# EAGLE design pic (EAGLE 5.06)
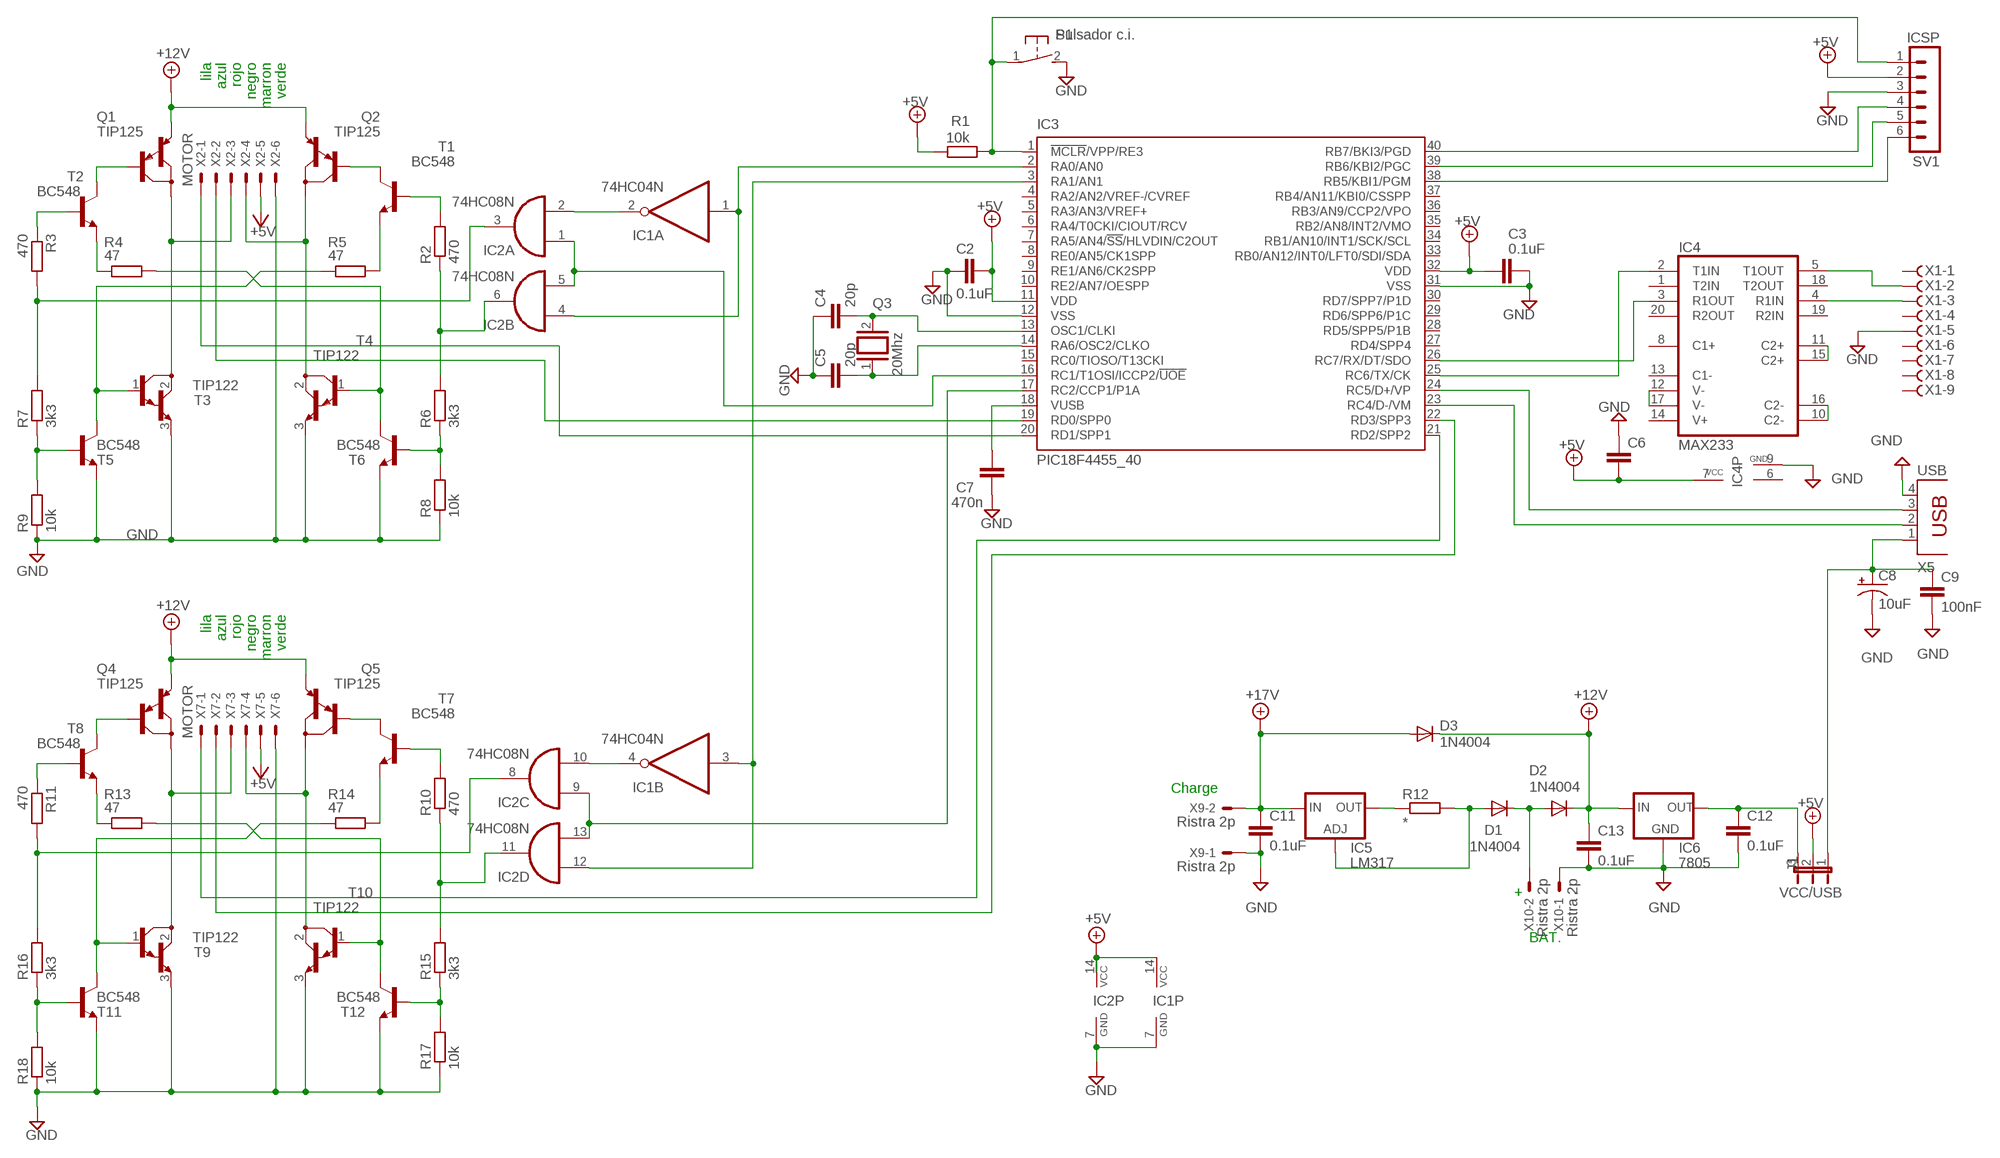
[diagram p0: schematic, sheet 1]

## Parts
C2  0.1uF  C2,5-3  [C2.5-3]
C3  0.1uF  C2,5-3  [C2.5-3]
C4  20p  C2,5-3  [C2.5-3]
C5  20p  C2,5-3  [C2.5-3]
C6  C2,5-3  [C2.5-3]
C7  470n  C2,5-3  [C2.5-3]
C8  10uF  CPOL-USE1.8-4  [E1,8-4]
C9  100nF  C2,5-3  [C2.5-3]
C11  0.1uF  C2,5-3  [C2.5-3]
C12  0.1uF  C2,5-3  [C2.5-3]
C13  0.1uF  C2,5-3  [C2.5-3]
D1  1N4004  [DO41-10]
D2  1N4004  [DO41-10]
D3  1N4004  [DO41-10]
IC1  74HC04N  [DIL14]
IC2  74HC08N  [DIL14]
IC3  PIC18F4455_40  [DIL40]
IC4  MAX233  [DIL20]
IC5  LM317  LM317TS  [317TS]
IC6  7805  78XXS  [78XXS]
J1  VCC/USB  JP2E  [JP2]
Q1  TIP125  [TO220V]
Q2  TIP125  [TO220V]
Q3  20Mhz  XTAL/S  [QS]
Q4  TIP125  [TO220V]
Q5  TIP125  [TO220V]
R1  10k  R-EU_0204/5  [0204/5]
R2  470  R-EU_0204/7  [0204/7]
R3  470  R-EU_0204/7  [0204/7]
R4  47  R-EU_0204/7  [0204/7]
R5  47  R-EU_0204/7  [0204/7]
R6  3k3  R-EU_0204/7  [0204/7]
R7  3k3  R-EU_0204/7  [0204/7]
R8  10k  R-EU_0204/7  [0204/7]
R9  10k  R-EU_0204/7  [0204/7]
R10  470  R-EU_0204/7  [0204/7]
R11  470  R-EU_0204/7  [0204/7]
R12  *  R-EU_0204/5  [0204/5]
R13  47  R-EU_0204/7  [0204/7]
R14  47  R-EU_0204/7  [0204/7]
R15  3k3  R-EU_0204/7  [0204/7]
R16  3k3  R-EU_0204/7  [0204/7]
R17  10k  R-EU_0204/7  [0204/7]
R18  10k  R-EU_0204/7  [0204/7]
S1  Pulsador c.i.  31-XX  [B3F-31XX]
SV1  ICSP  MA06-1  [MA06-1]
T1  BC548  [TO92-EBC]
T2  BC548  [TO92-EBC]
T3  TIP122  [TO220V]
T4  TIP122  [TO220V]
T5  BC548  [TO92-EBC]
T6  BC548  [TO92-EBC]
T7  BC548  [TO92-EBC]
T8  BC548  [TO92-EBC]
T9  TIP122  [TO220V]
T10  TIP122  [TO220V]
T11  BC548  [TO92-EBC]
T12  BC548  [TO92-EBC]
X1  F09HPS  [F09HP]
X2  MOTOR  C-GRID-06-70543  [70543-06]
X5  USB  PN61729  [PN61729]
X7  MOTOR  C-GRID-06-70543  [70543-06]
X9  Ristra 2p  KK-156-2  [KK-156-2]
X10  Ristra 2p  KK-156-2  [KK-156-2]

## Nets
+5V: C2.2 C3.1 C6.2 IC1.14(P:VCC) IC2.14(P:VCC) IC3.11(VDD) IC3.32(VDD) IC4.7(VCC) J1.2 R1.2 SV1.2 X2.5 X7.5
+12V: C13.1 D2.C D3.C IC6.IN Q1.3(E) Q2.3(E) Q4.3(E) Q5.3(E)
+17V: C11.1 D3.A IC5.3(IN) X9.2
ENC3: IC3.21(RD2/SPP2) X7.1
ENC4: IC3.22(RD3/SPP3) X7.2
GND: C2.1 C3.2 C4.1 C5.1 C6.1 C7.2 C8.- C9.2 C11.2 C12.2 C13.2 IC1.7(P:GND) IC2.7(P:GND) IC3.12(VSS) IC3.31(VSS) IC4.9(GND) IC6.GND R8.1 R9.1 R17.1 R18.1 S1.2(S) SV1.3 T3.3(E) T4.3(E) T5.E T6.E T9.3(E) T10.3(E) T11.E T12.E X1.5 X2.6 X5.4 X7.6 X9.1 X10.1
ICSP: IC3.1(!MCLR!/VPP/RE3) R1.1 S1.1(P) SV1.1
N$1: IC4.12(V-) IC4.17(V-)
N$2: C4.2 IC3.13(OSC1/CLKI) Q3.2
N$3: C5.2 IC3.14(RA6/OSC2/CLKO) Q3.1
N$4: IC3.23(RC4/D-/VM) X5.2
N$5: IC3.38(RB5/KBI1/PGM) SV1.6
N$7: IC4.11(C2+) IC4.15(C2+)
N$8: IC3.39(RB6/KBI2/PGC) SV1.5
N$9: IC3.40(RB7/BKI3/PGD) SV1.4
N$10: C8.+ C9.1 J1.1 X5.1
N$11: IC4.10(C2-) IC4.16(C2-)
N$12: R3.1 T2.B
N$13: IC5.2(OUT) R12.1
N$14: D1.A IC5.1(ADJ) R12.2
N$15: D1.C D2.A X10.2
N$17: IC2.9(C:I0) IC2.13(D:I1) IC3.17(RC2/CCP1/P1A)
N$18: C12.1 IC6.OUT J1.3
N$19: IC1.4(B:O) IC2.10(C:I1)
N$20: IC1.2(A:O) IC2.2(A:I1)
N$21: C7.1 IC3.18(VUSB)
N$22: IC4.5(T1OUT) X1.2
N$23: IC1.1(A:I) IC2.4(B:I0) IC3.2(RA0/AN0)
N$24: IC4.4(R1IN) X1.3
N$25: IC3.25(RC6/TX/CK) IC4.2(T1IN)
N$26: IC3.26(RC7/RX/DT/SDO) IC4.3(R1OUT)
N$27: IC3.24(RC5/D+/VP) X5.3
N$28: IC2.1(A:I0) IC2.5(B:I1) IC3.16(RC1/T1OSI/ICCP2/!UOE)
N$29: IC1.3(B:I) IC2.12(D:I0) IC3.3(RA1/AN1)
N$33: IC3.20(RD1/SPP1) X2.1
N$34: IC3.19(RD0/SPP0) X2.2
N$36: Q1.1(B) T2.C
N$37: R4.1 T2.E
N$38: Q1.2(C) T3.2(C) X2.3
N$39: R5.1 T3.1(B) T5.C
N$40: R7.1 R9.2 T5.B
N$41: Q2.2(C) T4.2(C) X2.4
N$42: R4.2 T4.1(B) T6.C
N$43: R6.1 R8.2 T6.B
N$44: R5.2 T1.E
N$45: Q2.1(B) T1.C
N$46: R2.2 T1.B
N$48: R11.1 T8.B
N$49: Q4.1(B) T8.C
N$50: R13.1 T8.E
N$51: Q4.2(C) T9.2(C) X7.3
N$52: R14.1 T9.1(B) T11.C
N$53: R16.1 R18.2 T11.B
N$54: Q5.2(C) T10.2(C) X7.4
N$55: R13.2 T10.1(B) T12.C
N$56: R15.1 R17.2 T12.B
N$57: R14.2 T7.E
N$58: Q5.1(B) T7.C
N$59: R10.2 T7.B
PWM1: IC2.3(A:O) R3.2 R7.2
PWM2: IC2.6(B:O) R2.1 R6.2
PWM3: IC2.8(C:O) R11.2 R16.2
PWM4: IC2.11(D:O) R10.1 R15.2
Unconnected: IC1.5(C:I) IC1.6(C:O) IC1.8(D:O) IC1.9(D:I) IC1.10(E:O) IC1.11(E:I) IC1.12(F:O) IC1.13(F:I) IC3.4(RA2/AN2/VREF-/CVREF) IC3.5(RA3/AN3/VREF+) IC3.6(RA4/T0CKI/CIOUT/RCV) IC3.7(RA5/AN4/!SS!/HLVDIN/C2OUT) IC3.8(RE0/AN5/CK1SPP) IC3.9(RE1/AN6/CK2SPP) IC3.10(RE2/AN7/OESPP) IC3.15(RC0/TIOSO/T13CKI) IC3.27(RD4/SPP4) IC3.28(RD5/SPP5/P1B) IC3.29(RD6/SPP6/P1C) IC3.30(RD7/SPP7/P1D) IC3.33(RB0/AN12/INT0/LFT0/SDI/SDA) IC3.34(RB1/AN10/INT1/SCK/SCL) IC3.35(RB2/AN8/INT2/VMO) IC3.36(RB3/AN9/CCP2/VPO) IC3.37(RB4/AN11/KBI0/CSSPP) IC4.1(T2IN) IC4.8(C1+) IC4.13(C1-) IC4.14(V+) IC4.18(T2OUT) IC4.19(R2IN) IC4.20(R2OUT) X1.1 X1.4 X1.6 X1.7 X1.8 X1.9

## Notes on the sheet
- lila | azul | rojo | negro | marron | verde
- lila | azul | rojo | negro | marron | verde
- Charge
- + | -
- BAT.

## Power pins joined to a net without a drawn wire
GND: IC4.6(GND)

## Library data of the parts
C2-C7 C9 C11-C13 = capacitor-wima:C: CAPACITOR naming: grid - package width
C8 = rcl:CPOL-US: POLARIZED CAPACITOR, American symbol
D1-D3 = diode:1N4004: DIODE general purpose rectifier, 1 A
IC1 = 74xx-eu:74*04: Hex INVERTER
IC2 = 74xx-eu:74*08: Quad 2-input AND gate
IC3 = microchip:PIC18F4*_40: USB Microcontrollers with nanoWatt Technology High-Performance, Enhanced Flash, 28/40/44-Pin, Source: http://ww1.microchip.com/downloads/en/devicedoc/39632c.pdf
IC4 = maxim:MAX233: RS232 TRANSEIVER
IC5 = v-reg:LM317TS: VOLTAGE REGULATOR
IC6 = v-reg:78XXS: VOLTAGE REGULATOR
J1 = jumper:JP2E: JUMPER
Q1 Q2 Q4 Q5 = transistor-pnp:TIP125: PNP Transistor
Q3 = special:XTAL/S: CRYSTAL
R1 R12 = rcl:R-EU_: RESISTOR, European symbol
R2-R11 R13-R18 = resistor:R-EU_: RESISTOR, European symbol
S1 = switch-omron:31-XX: OMRON SWITCH
SV1 = con-lstb:MA06-1: PIN HEADER
T1 T2 T5-T8 T11 T12 = transistor-npn:BC548*: NPN Transistor
T3 T4 T9 T10 = transistor-npn:TIP122*: NPN Darlington Transistor
X1 = con-subd:F09?S: SUB-D
X2 X7 = con-molex:C-GRID-06: CONNECTOR wire to board 2.54 mm (0.100") pitch header
X5 = con-berg:PN61729: BERG USB connector
X9 X10 = con-molex:KK-156-2: KK 156 HEADER Source: http://www.molex.com/pdm_docs/sd/026604100_sd.pdf

## Net classes
1 +5V: width 0.508 mm

## Board
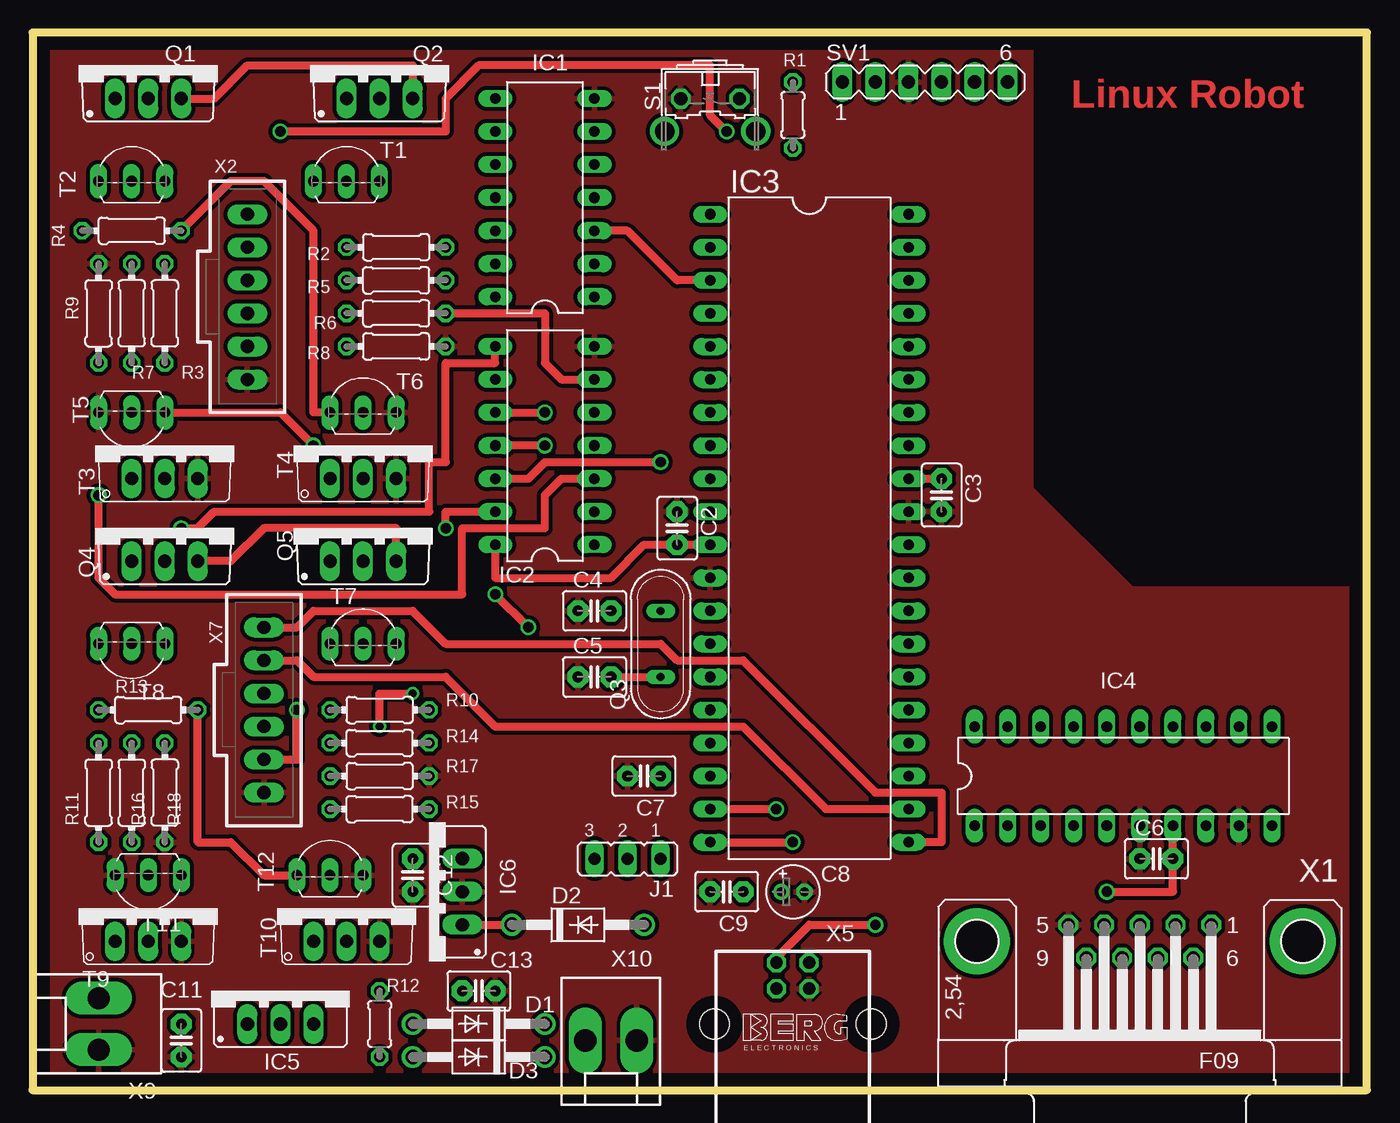
[diagram p1: board, top side]
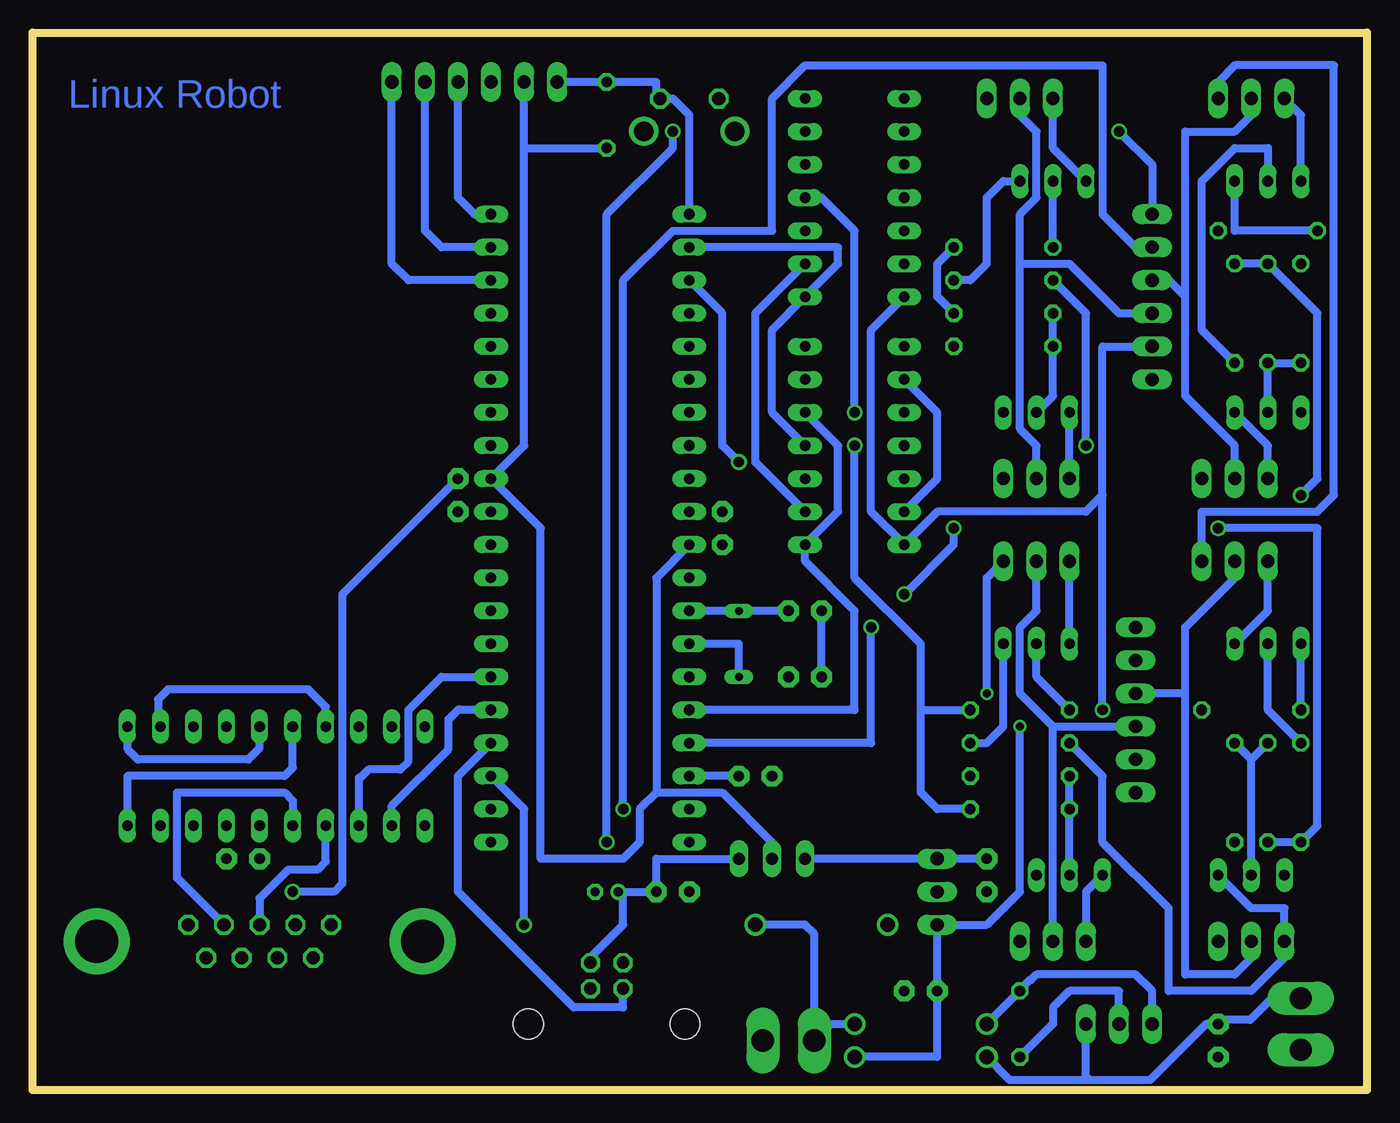
[diagram p2: board, bottom side, seen from below]

Size 102.54 x 81.27 mm. Coordinates in mm from the lower left corner, seen from the top.
Outline: 0,0 102.54,0 102.54,81.27 0,81.27 0,0
Copper layers (1*16): Top 0.035mm / dielectric 1.5mm / Bottom 0.035mm
Design rules "default *": minimum track width 24mil, minimum drill 0.6mm, track to track 12mil, track to pad 12mil, pad to pad 12mil, via to via 12mil, smd to smd 12mil, copper to edge 40mil, drill to drill 8mil, minimum pad ring 10mil, minimum via ring 8mil, stop-mask expansion 4mil, vias tented up to drill 0mil, thermal gap 10mil

### Footprints (pad centres in the part's own frame; a part is rotated, then mirrored left to right if it is on the bottom)
C2.5-3 = drill 0.813 pad 1.6 octagon: 1 -1.27,0; 2 1.27,0
E1,8-4 = drill 0.711 pad 1.168 round: + -0.889,0 | drill 0.711 pad 1.168 octagon: - 0.889,0
DO41-10 = drill 1.118 round: A 5.08,0; C -5.08,0
DIL14 = drill 0.813 long: 1 -7.62,-3.81; 2 -5.08,-3.81; 3 -2.54,-3.81; 4 0,-3.81; 5 2.54,-3.81; 6 5.08,-3.81; 7 7.62,-3.81; 8 7.62,3.81; 9 5.08,3.81; 10 2.54,3.81; 11 0,3.81; 12 -2.54,3.81; 13 -5.08,3.81; 14 -7.62,3.81
DIL40 = drill 0.813 long: 1 -24.13,-7.62; 2 -21.59,-7.62; 3 -19.05,-7.62; 4 -16.51,-7.62; 5 -13.97,-7.62; 6 -11.43,-7.62; 7 -8.89,-7.62; 8 -6.35,-7.62; 9 -3.81,-7.62; 10 -1.27,-7.62; 11 1.27,-7.62; 12 3.81,-7.62; 13 6.35,-7.62; 14 8.89,-7.62; 15 11.43,-7.62; 16 13.97,-7.62; 17 16.51,-7.62; 18 19.05,-7.62; 19 21.59,-7.62; 20 24.13,-7.62; 21 24.13,7.62; 22 21.59,7.62; 23 19.05,7.62; 24 16.51,7.62; 25 13.97,7.62; 26 11.43,7.62; 27 8.89,7.62; 28 6.35,7.62; 29 3.81,7.62; 30 1.27,7.62; 31 -1.27,7.62; 32 -3.81,7.62; 33 -6.35,7.62; 34 -8.89,7.62; 35 -11.43,7.62; 36 -13.97,7.62; 37 -16.51,7.62; 38 -19.05,7.62; 39 -21.59,7.62; 40 -24.13,7.62
DIL20 = drill 0.813 long: 1 -11.43,-3.81; 2 -8.89,-3.81; 3 -6.35,-3.81; 4 -3.81,-3.81; 5 -1.27,-3.81; 6 1.27,-3.81; 7 3.81,-3.81; 8 6.35,-3.81; 9 8.89,-3.81; 10 11.43,-3.81; 11 11.43,3.81; 12 8.89,3.81; 13 6.35,3.81; 14 3.81,3.81; 15 1.27,3.81; 16 -1.27,3.81; 17 -3.81,3.81; 18 -6.35,3.81; 19 -8.89,3.81; 20 -11.43,3.81
317TS = drill 1.016 long: 1 -2.54,-2.54; 2 0,-2.54; 3 2.54,-2.54
78XXS = drill 1.016 long: GND 0,-2.54; IN -2.54,-2.54; OUT 2.54,-2.54
JP2 = drill 0.914 long: 1 -2.54,0; 2 0,0; 3 2.54,0
TO220V = drill 1.016 long: 1 -2.54,-2.54; 2 0,-2.54; 3 2.54,-2.54
QS = drill 0.61 long: 1 -2.54,0; 2 2.54,0
0204/5 = drill 0.813 octagon: 1 -2.54,0; 2 2.54,0
0204/7 = drill 0.813 octagon: 1 -3.81,0; 2 3.81,0
B3F-31XX = drill 1.016 octagon: 1 -2.261,-1.245; 2 2.261,-1.245 | drill 1.499 pad 2.159 round: 3 -3.505,1.245; 4 3.505,1.245
MA06-1 = drill 1.016 long: 1 -6.35,0; 2 -3.81,0; 3 -1.27,0; 4 1.27,0; 5 3.81,0; 6 6.35,0
TO92-EBC = drill 0.813 long: B 0,-1.27; C -2.54,-1.27; E 2.54,-1.27
F09HP = drill 1.016 octagon: 1 -5.486,-1.27; 2 -2.743,-1.27; 3 0,-1.27; 4 2.743,-1.27; 5 5.486,-1.27; 6 -4.115,1.27; 7 -1.372,1.27; 8 1.372,1.27; 9 4.115,1.27 | drill 3.302 pad 5.08 round: G1 -12.522,0; G2 12.522,0
70543-06 = drill 1.016 long: 1 -6.35,0; 2 -3.81,0; 3 -1.27,0; 4 1.27,0; 5 3.81,0; 6 6.35,0
PN61729 = drill 0.95 octagon: 1 1.25,4.71; 2 -1.25,4.71; 3 -1.25,2.71; 4 1.25,2.71 | hole 2.3: -6.02,0; 6.02,0
KK-156-2 = drill 1.7 pad 2.184 long: 1 -1.98,0; 2 1.98,0

### Placement (x,y rotation side)
C2  49.53,43.18 270 top
C3  69.85,45.72 270 top
C4  43.18,36.83 0 top
C5  43.18,31.75 0 top
C6  86.36,17.78 0 top
C7  46.99,24.13 180 top
C8  58.42,15.24 0 top
C9  53.34,15.24 180 top
C11  11.43,3.81 270 top
C12  29.21,16.51 270 top
C13  34.29,7.62 0 top
D1  34.29,5.08 180 top
D2  41.91,12.7 0 top
D3  34.29,2.54 180 top
IC1  39.37,68.58 90 top
IC2  39.37,49.53 90 top
IC3  59.69,43.18 270 top
IC4  83.82,24.13 0 top
IC5  19.05,7.62 0 top
IC6  30.48,15.24 90 top
J1  45.72,17.78 180 top
Q1  8.89,78.74 0 top
Q2  26.67,78.74 0 top
Q3  48.26,34.29 90 top
Q4  10.16,43.18 0 top
Q5  25.4,43.18 0 top
R1  58.42,74.93 270 top
R2  27.94,64.77 180 top
R3  10.16,59.69 90 top
R4  7.62,66.04 0 top
R5  27.94,62.23 0 top
R6  27.94,59.69 0 top
R7  7.62,59.69 90 top
R8  27.94,57.15 180 top
R9  5.08,59.69 270 top
R10  26.67,29.21 180 top
R11  5.08,22.86 270 top
R12  26.67,5.08 90 top
R13  8.89,29.21 0 top
R14  26.67,26.67 0 top
R15  26.67,21.59 0 top
R16  7.62,22.86 270 top
R17  26.67,24.13 180 top
R18  10.16,22.86 90 top
S1  52.07,74.93 180 top
SV1  68.58,77.47 0 top
T1  24.13,71.12 0 top
T2  7.62,71.12 0 top
T3  10.16,49.53 0 top
T4  25.4,49.53 0 top
T5  7.62,50.8 180 top
T6  25.4,53.34 0 top
T7  25.4,35.56 0 top
T8  7.62,33.02 180 top
T9  8.89,13.97 0 top
T10  24.13,13.97 0 top
T11  8.89,15.24 180 top
T12  22.86,17.78 0 top
X1  85.09,11.43 180 top
X2  16.51,60.96 270 top
X5  58.42,5.08 0 top
X7  17.78,29.21 270 top
X9  5.08,5.08 90 top
X10  44.45,3.81 180 top

### Tracks (layer width: path | path; a pad name or v marks a point on that pad's centre or on a via)
+5V  (via drill 0.8)
  Top 0.61: X7.5 20.32,25.4 v20.32,29.21 | IC3.11 C2.2 46.99,41.91 44.45,39.37 35.56,39.37 IC2.14 | IC4.7 C6.2 87.63,15.24 v82.55,15.24 | IC3.32 C3.1
  Bottom 0.61: IC1.14 38.1,58.42 38.1,44.45 IC2.14 33.02,44.45 21.59,44.45 20.32,45.72 | X2.5 20.32,57.15 20.32,45.72 | v20.32,29.21 20.32,45.72 | J1.2 45.72,19.05 49.53,22.86 54.61,22.86 | 54.61,22.86 54.61,39.37 IC3.11 | 64.77,72.39 R1.2 | 64.77,72.39 SV1.2 | 64.77,72.39 64.77,49.53 IC3.32 63.5,43.18 63.5,17.78 57.15,17.78 55.88,19.05 55.88,21.59 54.61,22.86 | C3.1 78.74,38.1 78.74,15.88 79.38,15.24 v82.55,15.24
+12V  (via drill 0.6)
  Top 0.61: Q5.3 27.94,43.18 17.78,43.18 15.24,40.64 Q4.3 | Q2.3 29.21,78.74 16.51,78.74 13.97,76.2 Q1.3 | IC6.IN D2.C | v26.67,27.94 26.67,30.48 v29.21,30.48
  Bottom 0.61: D3.C 33.02,2.54 C13.1 IC6.IN 29.21,12.7 26.67,15.24 v26.67,27.94 | Q1.3 11.43,77.47 10.16,78.74 2.54,78.74 2.54,45.72 3.81,44.45 12.7,44.45 Q4.3 | v29.21,30.48 29.21,39.37 Q5.3
+17V
  Bottom 0.61: X9.2 7.3,7.06 8.97,5.39 11.12,5.39 C11.1 12.36,5.08 16.67,0.77 21.29,0.77 | 21.29,0.77 27.44,0.77 D3.A | IC5.3 21.59,1.07 21.29,0.77
ENC3
  Top 0.61: IC3.21 69.85,19.05 69.85,22.86 64.77,22.86 54.61,33.02 49.53,33.02 48.26,34.29 31.75,34.29 29.21,36.83 21.59,36.83 20.32,35.56 X7.1
ENC4
  Top 0.61: IC3.22 60.96,21.59 54.61,27.94 35.56,27.94 31.75,31.75 21.59,31.75 20.32,33.02 X7.2
GND
  Bottom 0.61: C5.1 C4.1
  pour Top: -1.81,83.16 -1.81,-3.08 104.45,-3.08 104.45,0 104.45,38.5 84.43,38.5 76.73,46.2 76.73,80.08 73.65,83.16
ICSP
  Bottom 0.61: SV1.1 R1.1 54.61,77.47 54.61,76.2 | IC3.1 52.07,74.93 53.34,76.2 54.61,76.2 | 54.61,76.2 S1.1
N$1
  Bottom 0.61: IC4.17 80.01,29.46 81.35,30.8 92.13,30.8 92.9,30.03 92.9,28.13 IC4.12
N$2
  Bottom 0.61: C4.2 Q3.2 IC3.13
N$3
  Top 0.61: C5.2 Q3.1
  Bottom 0.61: IC3.14 48.26,34.29 Q3.1
N$4  (via drill 0.8)
  Top 0.61: X5.2 57.17,10.18 59.69,12.7 v64.77,12.7
  Bottom 0.61: IC3.23 64.77,21.59 v64.77,12.7
N$5
  Bottom 0.61: IC3.38 73.66,62.23 74.93,63.5 SV1.6
N$7
  Bottom 0.61: IC4.15 85.09,26.29 85.97,25.41 94.44,25.41 95.21,26.18 95.21,27.9 IC4.11
N$8
  Bottom 0.61: IC3.39 71.12,64.77 72.39,66.04 SV1.5
N$9
  Bottom 0.61: IC3.40 68.58,67.31 69.85,68.58 SV1.4
N$10
  Bottom 0.61: 57.15,15.24 C9.1 54.61,17.78 J1.1 | 57.15,15.24 57.15,12.7 59.69,10.16 X5.1 | 57.15,15.24 C8.+
N$11
  Bottom 0.61: IC4.10 95.25,24.13 83.19,24.13 82.55,24.77 IC4.16
N$12
  Bottom 0.61: R3.1 12.7,58.42 12.7,69.85 10.16,72.39 7.62,72.39 T2.B
N$13
  Bottom 0.61: R12.1 24.13,5.08 24.13,6.35 22.86,7.62 19.05,7.62 IC5.2
N$14
  Bottom 0.61: IC5.1 16.51,7.62 17.78,8.89 25.4,8.89 25.82,8.47 25.91,8.47 26.67,7.71 R12.2 D1.A
N$15
  Bottom 0.61: D1.C 41.2,5.08 X10.2 42.47,11.99 43.18,12.7 D2.A
N$17  (via drill 0.8)
  Top 0.61: v38.1,35.56 v35.56,38.1 | v31.75,43.18 31.75,44.45 IC2.13
  Bottom 0.61: IC2.13 33.02,46.99 33.02,52.07 IC2.9 | IC3.17 38.1,26.67 v38.1,35.56 | v35.56,38.1 31.75,41.91 v31.75,43.18
N$18
  Bottom 0.61: C12.1 IC6.OUT J1.3
N$19  (via drill 0.8)
  Top 0.61: IC2.10 v39.37,52.07
  Bottom 0.61: v39.37,52.07 39.37,66.04 41.91,68.58 IC1.4
N$20
  Bottom 0.61: IC2.2 46.99,48.26 46.99,59.69 IC1.2
N$21
  Bottom 0.61: C7.1 IC3.18
N$22
  Bottom 0.61: 87.63,12.7 X1.2 91.44,16.31 91.44,22.86 83.19,22.86 82.55,22.23 IC4.5
N$23
  Bottom 0.61: IC2.4 45.72,52.07 45.72,58.42 IC1.1 40.64,63.5 40.64,64.77 IC3.2
N$24
  Bottom 0.61: X1.3 85.09,14.74 82.89,16.94 80.64,16.94 80.01,17.57 IC4.4
N$25
  Bottom 0.61: IC4.2 74.93,21.82 70.57,26.18 70.57,28.49 69.8,29.26 67.36,29.26 IC3.25
N$26
  Bottom 0.61: IC3.26 71.12,31.75 73.66,29.21 73.66,26.19 73.65,26.18 73.65,25.27 74.28,24.64 76.73,24.64 77.36,24 77.47,24 IC4.3
N$27
  Bottom 0.61: IC3.24 69.85,24.13 69.85,15.24 60.96,6.35 57.15,6.35 57.15,7.62 X5.3
N$28
  Bottom 0.61: IC2.5 40.64,49.53 40.64,44.45 IC2.1 43.18,40.64 39.37,36.83 39.37,29.21 IC3.16
N$29  (via drill 0.8)
  Top 0.61: IC2.12 38.1,46.99 39.37,48.26 v48.26,48.26 | IC1.3 45.72,66.04 49.53,62.23 IC3.3
  Bottom 0.61: v48.26,48.26 49.53,49.53 49.53,59.69 IC3.3
N$33  (via drill 0.8)
  Top 0.61: IC3.20 v58.42,19.05 | v53.34,73.66 52.07,74.93 52.07,78.74 34.29,78.74 31.75,76.2 31.75,73.66 v19.05,73.66
  Bottom 0.61: v58.42,19.05 58.42,67.31 53.34,72.39 v53.34,73.66 | v19.05,73.66 16.51,71.12 X2.1
N$34  (via drill 0.8)
  Top 0.61: IC3.19 v57.15,21.59
  Bottom 0.61: v57.15,21.59 57.15,62.23 53.34,66.04 45.72,66.04 45.72,76.2 43.18,78.74 20.32,78.74 20.32,67.31 17.78,64.77 X2.2
N$36
  Bottom 0.61: T2.C 5.08,74.93 Q1.1
N$37
  Bottom 0.61: R4.1 10.16,66.04 T2.E
N$38
  Bottom 0.61: T3.2 10.16,49.53 13.97,53.34 13.97,60.96 | 13.97,60.96 15.24,62.23 X2.3 | Q1.2 8.89,74.93 10.16,73.66 13.97,73.66 13.97,60.96
N$39  (via drill 0.8)
  Top 0.61: v21.59,49.53 19.05,52.07 T5.C
  Bottom 0.61: T5.C 7.62,49.53 T3.1 | R5.1 21.59,59.69 v21.59,49.53
N$40
  Bottom 0.61: R9.2 R7.1 T5.B
N$41
  Bottom 0.61: T4.2 25.4,49.53 26.67,50.8 26.67,63.5 | 26.67,63.5 26.67,67.31 25.4,68.58 25.4,73.66 26.67,74.93 Q2.2 | 26.67,63.5 22.86,63.5 19.05,59.69 X2.4
N$42
  Top 0.61: T6.C 21.59,52.07 21.59,66.04 17.78,69.85 15.24,69.85 R4.2
  Bottom 0.61: T4.1 T6.C
N$43
  Bottom 0.61: R6.1 R8.2 24.13,53.34 T6.B
N$44
  Bottom 0.61: T1.E 27.94,69.85 29.21,68.58 29.21,63.5 30.48,62.23 R5.2
N$45
  Bottom 0.61: T1.C 24.13,72.39 Q2.1
N$46
  Bottom 0.61: R2.2 T1.B
N$48
  Bottom 0.61: R11.1 7.62,29.21 T8.B
N$49
  Bottom 0.61: T8.C 7.62,36.83 Q4.1
N$50
  Bottom 0.61: R13.1 T8.E
N$51
  Bottom 0.61: T9.2 8.89,10.16 10.16,8.89 13.97,8.89 13.97,30.48 | 13.97,30.48 13.97,35.56 10.16,39.37 Q4.2 | 13.97,30.48 X7.3
N$52
  Bottom 0.61: T11.C 8.89,13.97 6.35,13.97 T9.1 6.35,10.16 8.89,7.62 15.24,7.62 15.24,13.97 20.32,19.05 20.32,24.13 R14.1
N$53
  Bottom 0.61: T11.B 8.89,25.4 | 8.89,25.4 R16.1 | 8.89,25.4 R18.2
N$54
  Bottom 0.61: T10.2 24.13,27.94 | 24.13,27.94 X7.4 | Q5.2 25.4,36.83 26.67,35.56 26.67,30.48 24.13,27.94
N$55
  Top 0.61: R13.2 12.7,19.05 15.24,19.05 17.78,16.51 T12.C
  Bottom 0.61: T12.C 21.59,15.24 T10.1
N$56
  Bottom 0.61: T12.B R15.1 R17.2
N$57
  Bottom 0.61: R14.2 29.21,26.67 27.94,27.94 T7.E
N$58
  Bottom 0.61: T7.C Q5.1
N$59
  Bottom 0.61: R10.2 25.4,31.75 T7.B
PWM1  (via drill 0.8)
  Top 0.61: IC2.3 40.64,46.99 39.37,45.72 39.37,43.18 33.02,43.18 33.02,38.1 6.35,38.1 5.08,39.37 v5.08,45.72
  Bottom 0.61: R3.2 R7.2 3.81,59.69 3.81,46.99 v5.08,45.72
PWM2
  Top 0.61: IC2.6 40.64,54.61 39.37,55.88 39.37,59.69 R6.2
  Bottom 0.61: R2.1 33.02,63.5 33.02,60.96 R6.2
PWM3  (via drill 0.8)
  Top 0.61: IC2.8 35.56,55.88 31.75,55.88 31.75,48.26 30.48,48.26 30.48,44.45 13.97,44.45 12.7,43.18 v11.43,43.18
  Bottom 0.61: R16.2 R11.2 3.81,20.32 3.81,43.18 v11.43,43.18
PWM4  (via drill 0.8)
  Top 0.61: v39.37,49.53 IC2.11
  Bottom 0.61: v39.37,49.53 39.37,39.37 34.29,34.29 34.29,29.21 | 34.29,29.21 R10.1 | 34.29,29.21 34.29,22.86 33.02,21.59 R15.2

### Text on the board
Top: Linux Robot
Bottom: Linux Robot